# Altium schematic sheet PERIPHERALS.SchDoc
size A; SheetNumber: 3; SheetTotal: 3
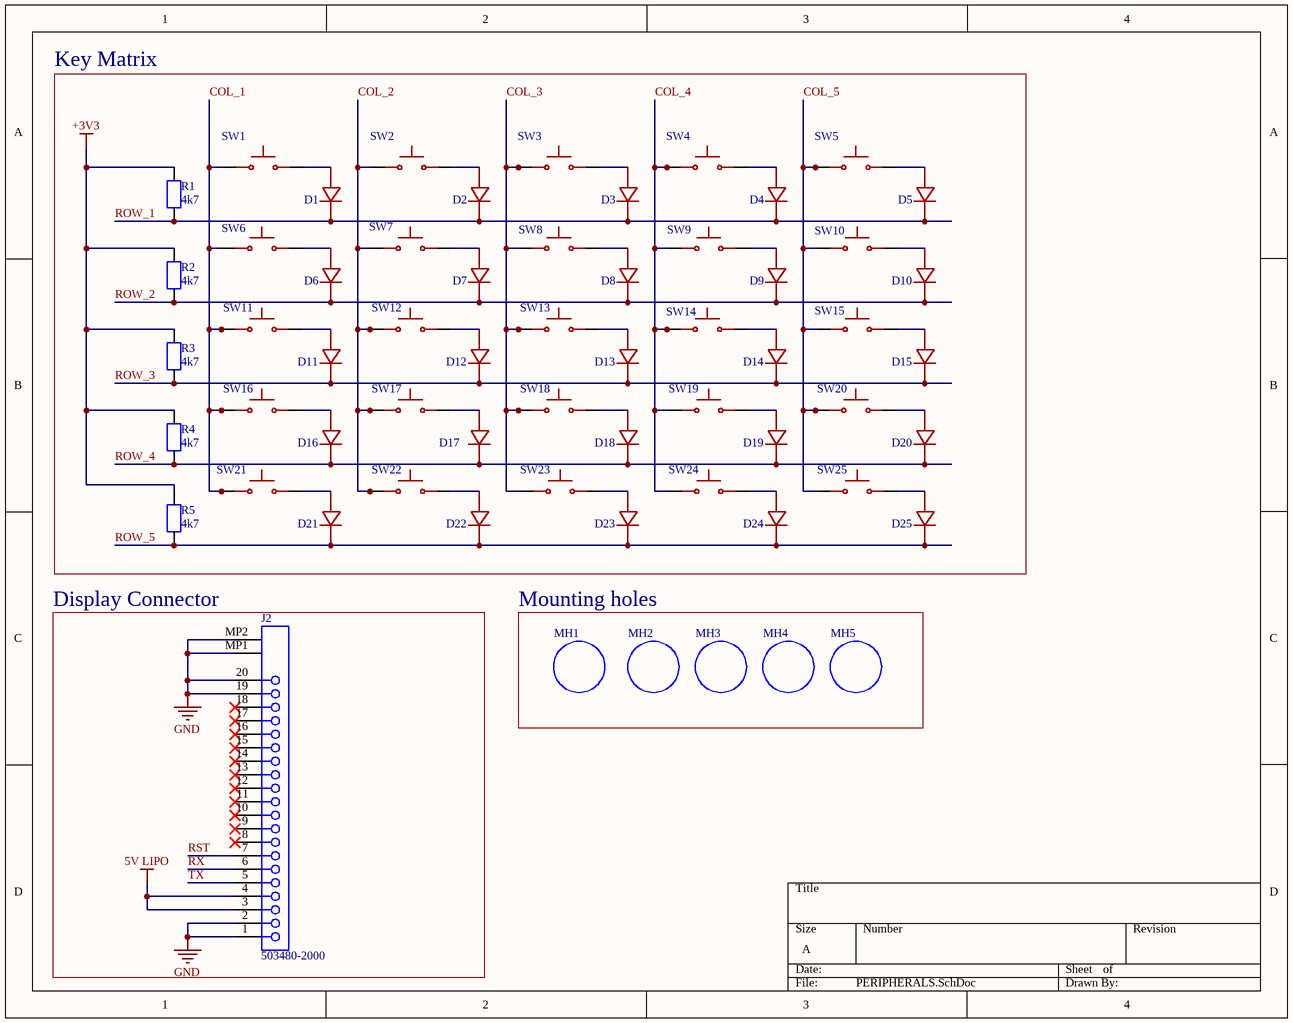
[diagram p0: PERIPHERALS.SchDoc]

## Parts
D1  SOD-323  [SOD-323]  (value not drawn)
D2  SOD-323  [SOD-323]  (value not drawn)
D3  SOD-323  [SOD-323]  (value not drawn)
D4  SOD-323  [SOD-323]  (value not drawn)
D5  SOD-323  [SOD-323]  (value not drawn)
D6  SOD-323  [SOD-323]  (value not drawn)
D7  SOD-323  [SOD-323]  (value not drawn)
D8  SOD-323  [SOD-323]  (value not drawn)
D9  SOD-323  [SOD-323]  (value not drawn)
D10  SOD-323  [SOD-323]  (value not drawn)
D11  SOD-323  [SOD-323]  (value not drawn)
D12  SOD-323  [SOD-323]  (value not drawn)
D13  SOD-323  [SOD-323]  (value not drawn)
D14  SOD-323  [SOD-323]  (value not drawn)
D15  SOD-323  [SOD-323]  (value not drawn)
D16  SOD-323  [SOD-323]  (value not drawn)
D17  SOD-323  [SOD-323]  (value not drawn)
D18  SOD-323  [SOD-323]  (value not drawn)
D19  SOD-323  [SOD-323]  (value not drawn)
D20  SOD-323  [SOD-323]  (value not drawn)
D21  SOD-323  [SOD-323]  (value not drawn)
D22  SOD-323  [SOD-323]  (value not drawn)
D23  SOD-323  [SOD-323]  (value not drawn)
D24  SOD-323  [SOD-323]  (value not drawn)
D25  SOD-323  [SOD-323]  (value not drawn)
J2  503480-2000  [MOLX-503480-2000]
MH1  m2 mounting hole  [m2 mounting hole]  (value not drawn)
MH2  m2 mounting hole  [m2 mounting hole]  (value not drawn)
MH3  m2 mounting hole  [m2 mounting hole]  (value not drawn)
MH4  m2 mounting hole  [m2 mounting hole]  (value not drawn)
MH5  m2 mounting hole  [m2 mounting hole]  (value not drawn)
R1  4k7  [0603 resistor]
R2  4k7  [0603 resistor]
R3  4k7  [0603 resistor]
R4  4k7  [0603 resistor]
R5  4k7  [0603 resistor]
SW1  switch  [chocv1]  (value not drawn)
SW2  switch  [chocv1]  (value not drawn)
SW3  switch  [chocv1]  (value not drawn)
SW4  switch  [chocv1]  (value not drawn)
SW5  switch  [chocv1]  (value not drawn)
SW6  switch  [chocv1]  (value not drawn)
SW7  switch  [chocv1]  (value not drawn)
SW8  switch  [chocv1]  (value not drawn)
SW9  switch  [chocv1]  (value not drawn)
SW10  switch  [chocv1]  (value not drawn)
SW11  switch  [chocv1]  (value not drawn)
SW12  switch  [chocv1]  (value not drawn)
SW13  switch  [chocv1]  (value not drawn)
SW14  switch  [chocv1]  (value not drawn)
SW15  switch  [chocv1]  (value not drawn)
SW16  switch  [chocv1]  (value not drawn)
SW17  switch  [chocv1]  (value not drawn)
SW18  switch  [chocv1]  (value not drawn)
SW19  switch  [chocv1]  (value not drawn)
SW20  switch  [chocv1]  (value not drawn)
SW21  switch  [chocv1]  (value not drawn)
SW22  switch  [chocv1]  (value not drawn)
SW23  switch  [chocv1]  (value not drawn)
SW24  switch  [chocv1]  (value not drawn)
SW25  switch  [chocv1]  (value not drawn)

## Blocks framed on the sheet
Key Matrix: D1-D25 R1-R5 SW1-SW25
Display Connector: J2
Mounting holes: MH1-MH5

## Nets
5V LIPO: J2.3 J2.4
+3V3: R1.2 R2.2 R3.2 R4.2 R5.2
GND: J2.1 J2.2 J2.19 J2.20 J2.MP1 J2.MP2
COL_1: SW1.2 SW6.2 SW11.2 SW16.2 SW21.2
COL_2: SW2.2 SW7.2 SW12.2 SW17.2 SW22.2
COL_3: SW3.2 SW8.2 SW13.2 SW18.2 SW23.2
COL_4: SW4.2 SW9.2 SW14.2 SW19.2 SW24.2
COL_5: SW5.2 SW10.2 SW15.2 SW20.2 SW25.2
ROW_1: D1.1(C) D2.1(C) D3.1(C) D4.1(C) D5.1(C) R1.1
ROW_2: D6.1(C) D7.1(C) D8.1(C) D9.1(C) D10.1(C) R2.1
ROW_3: D11.1(C) D12.1(C) D13.1(C) D14.1(C) D15.1(C) R3.1
ROW_4: D16.1(C) D17.1(C) D18.1(C) D19.1(C) D20.1(C) R4.1
ROW_5: D21.1(C) D22.1(C) D23.1(C) D24.1(C) D25.1(C) R5.1
RST: J2.7
RX: J2.6
TX: J2.5
NetD1_2: D1.2(A) SW1.1
NetD2_2: D2.2(A) SW2.1
NetD3_2: D3.2(A) SW3.1
NetD4_2: D4.2(A) SW4.1
NetD5_2: D5.2(A) SW5.1
NetD6_2: D6.2(A) SW6.1
NetD7_2: D7.2(A) SW7.1
NetD8_2: D8.2(A) SW8.1
NetD9_2: D9.2(A) SW9.1
NetD10_2: D10.2(A) SW10.1
NetD11_2: D11.2(A) SW11.1
NetD12_2: D12.2(A) SW12.1
NetD13_2: D13.2(A) SW13.1
NetD14_2: D14.2(A) SW14.1
NetD15_2: D15.2(A) SW15.1
NetD16_2: D16.2(A) SW16.1
NetD17_2: D17.2(A) SW17.1
NetD18_2: D18.2(A) SW18.1
NetD19_2: D19.2(A) SW19.1
NetD20_2: D20.2(A) SW20.1
NetD21_2: D21.2(A) SW21.1
NetD22_2: D22.2(A) SW22.1
NetD23_2: D23.2(A) SW23.1
NetD24_2: D24.2(A) SW24.1
NetD25_2: D25.2(A) SW25.1

Not connected (* = marked no-connect by the designer): J2 8* 9* 10* 11* 12* 13* 14* 15* 16* 17* 18*

## Library data of the parts
D1-D25 = SOD-323: 1N4148WS
J2 = CMP-1241-00121-1: 0.5 mm Pitch Easy-On(TM) BackFlip(TM) Type FPC Connector, 1.0 mm Mated Height, Right Angle, SMT, Dual Contact, 20 Circuits, -40 to 85 degC, ELV and RoHS Compliant, Tape and Reel; Manufacturer: Molex; Durability (mating cycles max): 10; Material - Plating Mating: Gold; Stackable: No; Voltage (Max): 50V AC (RMS)/DC; Material - Metal: Phosphor Bronze; Entry Angle: 90degrees Angle; Mated Height: 1.00mm; Polarized to PCB: Yes; Pitch - Mating Interface: 0.50mm; Circuits (Loaded): 20; Current (Max per Contact): 0.5A; Material - Plating Termination: Gold, Tin; ComponentLink3Description: Package Specification; ComponentLink1Description: Manufacturer URL; RoHS: TRUE; ComponentLink2Description: Datasheet; Packing: Tape and Reel; ComponentLink2URL: http://www.molex.com/webdocs/datasheets/pdf/en-us/5034802000_FFC_FPC_CONNECTORS.pdf; ComponentLink3URL: http://www.molex.com/pdm_docs/sd/5034802000_sd.pdf; Contact Position: Dual; Mounting Technology: Surface Mount; PackageDescription: 20-Lead FPC Connector, Pitch 0.5 mm; PackageVersion: Rev. F, 09/2012; ComponentLink1URL: http://www.molex.com/molex/index.jsp; PCB Locator: No; PartNumber: 503480-2000; Number of Rows: 1; Orientation: Right Angle; PCB Retention: Yes; PackageReference: 503480-2000
R1-R5 = 0603 resistor